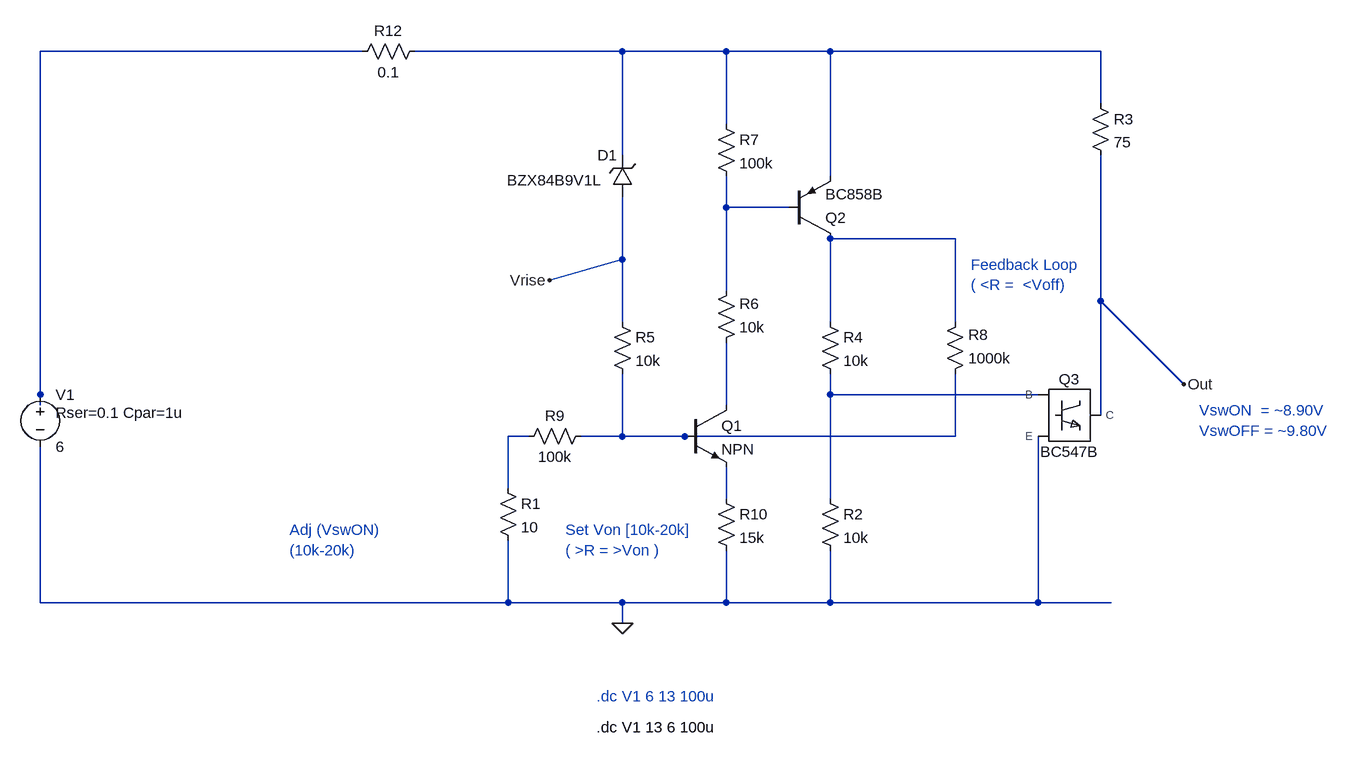
[diagram p0: schematic V0_SW10n.asc]
V0_SW10n.asc, the LTspice schematic file:
Version 4
SHEET 1 2188 680
WIRE -304 -480 -800 -480
WIRE 96 -480 -224 -480
WIRE 256 -480 96 -480
WIRE 416 -480 256 -480
WIRE 832 -480 416 -480
WIRE 832 -400 832 -480
WIRE 256 -368 256 -480
WIRE 96 -320 96 -480
WIRE 416 -288 416 -480
WIRE 256 -240 256 -288
WIRE 352 -240 256 -240
WIRE 608 -192 416 -192
WIRE 96 -160 96 -256
WIRE -16 -128 96 -160
WIRE 256 -112 256 -240
WIRE 832 -96 832 -320
WIRE 96 -64 96 -160
WIRE 416 -64 416 -192
WIRE 608 -64 608 -192
WIRE 960 32 832 -96
WIRE -800 48 -800 -480
WIRE 416 48 416 16
WIRE 736 48 416 48
WIRE -800 64 -800 48
WIRE 256 64 256 -32
WIRE 832 80 832 -96
WIRE -48 112 -80 112
WIRE 96 112 96 16
WIRE 96 112 32 112
WIRE 192 112 96 112
WIRE 608 112 608 16
WIRE 608 112 192 112
WIRE -80 192 -80 112
WIRE 256 208 256 160
WIRE 416 208 416 48
WIRE -800 368 -800 128
WIRE -80 368 -80 272
WIRE -80 368 -800 368
WIRE 96 368 -80 368
WIRE 256 368 256 288
WIRE 256 368 96 368
WIRE 416 368 416 288
WIRE 416 368 256 368
WIRE 736 368 736 112
WIRE 736 368 416 368
WIRE 848 368 736 368
WIRE 96 400 96 368
FLAG 96 400 0
FLAG 960 32 Out
FLAG -16 -128 Vrise
SYMBOL res -96 176 R0
SYMATTR InstName R1
SYMATTR Value 10
SYMBOL res 80 -80 R0
SYMATTR InstName R5
SYMATTR Value 10k
SYMBOL zener 112 -256 R180
WINDOW 0 24 64 Left 2
WINDOW 3 48 26 Left 2
SYMATTR InstName D1
SYMATTR Value BZX84B9V1L
SYMBOL res 816 -416 R0
SYMATTR InstName R3
SYMATTR Value 75
SYMBOL voltage -800 32 R0
WINDOW 123 0 0 Left 0
WINDOW 39 24 44 Left 2
SYMATTR SpiceLine Rser=0.1 Cpar=1u
SYMATTR InstName V1
SYMATTR Value 6
SYMBOL res 240 -16 M180
WINDOW 0 36 76 Left 2
WINDOW 3 36 40 Left 2
SYMATTR InstName R6
SYMATTR Value 10k
SYMBOL pnp 352 -192 M180
SYMATTR InstName Q2
SYMATTR Value BC858B
SYMBOL res 240 -384 R0
SYMATTR InstName R7
SYMATTR Value 100k
SYMBOL npn 192 64 R0
SYMATTR InstName Q1
SYMBOL res 400 192 R0
SYMATTR InstName R2
SYMATTR Value 10k
SYMBOL res 400 -80 R0
SYMATTR InstName R4
SYMATTR Value 10k
SYMBOL res 592 32 M180
WINDOW 0 36 76 Left 2
WINDOW 3 36 40 Left 2
SYMATTR InstName R8
SYMATTR Value 1000k
SYMBOL res 48 96 R90
WINDOW 0 0 56 VBottom 2
WINDOW 3 32 56 VTop 2
SYMATTR InstName R9
SYMATTR Value 100k
SYMBOL res 240 192 R0
SYMATTR InstName R10
SYMATTR Value 15k
SYMBOL res -208 -496 R90
WINDOW 0 0 56 VBottom 2
WINDOW 3 32 56 VTop 2
SYMATTR InstName R12
SYMATTR Value 0.1
SYMBOL smt_npn 784 80 R0
SYMATTR InstName Q3
TEXT 56 512 Left 2 ;.dc V1 6 13 100u
TEXT 56 560 Left 2 !.dc V1 13 6 100u
TEXT 8 256 Left 2 ;Set Von [10k-20k]\n( >R = >Von )
TEXT 632 -152 Left 2 ;Feedback Loop\n( <R =  <Voff)
TEXT 984 72 Left 2 ;VswON  = ~8.90V\nVswOFF = ~9.80V
TEXT -416 256 Left 2 ;Adj (VswON)\n(10k-20k)

The netlist it stands for:
* V0_SW10n.asc
R1 N007 0 10
R5 Vrise N008 10k
D1 Vrise N002 BZX84B9V1L
R3 N002 Out 75
V1 N001 0 6 Rser=0.1 Cpar=1u
R6 N006 N003 10k
Q2 N004 N003 N002 0 BC858B
R7 N002 N003 100k
Q1 N006 N008 N009 0 NPN
R2 N005 0 10k
R4 N004 N005 10k
R8 N008 N004 1000k
R9 N008 N007 100k
R10 N009 0 15k
R12 N002 N001 0.1
Q3 Out N005 0 0 BC547B
.model D D
.lib standard.dio
.model NPN NPN
.model PNP PNP
.lib standard.bjt
* .dc V1 6 13 100u
.dc V1 13 6 100u
* Set Von [10k-20k]
* ( >R = >Von )
* Feedback Loop
* ( <R =  <Voff)
* VswON  = ~8.90V
* VswOFF = ~9.80V
* Adj (VswON)
* (10k-20k)
.backanno
.end